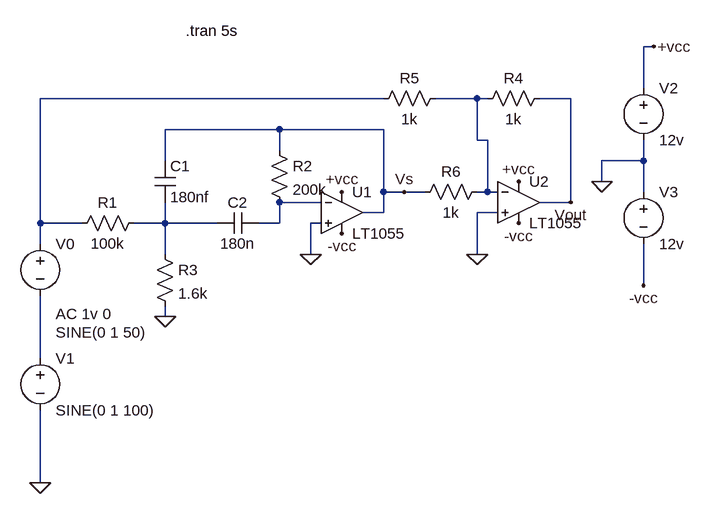
[diagram p0: schematic filtre-exo5.asc]
filtre-exo5.asc, the LTspice schematic file:
Version 4
SHEET 1 952 720
WIRE 880 -96 864 -96
WIRE 864 -32 864 -96
WIRE 464 -16 -64 -16
WIRE 608 -16 544 -16
WIRE 624 -16 608 -16
WIRE 752 -16 704 -16
WIRE 304 32 128 32
WIRE 464 32 304 32
WIRE 608 48 608 -16
WIRE 624 48 608 48
WIRE 304 64 304 32
WIRE 128 80 128 32
WIRE 864 80 864 48
WIRE 864 80 800 80
WIRE 800 112 800 80
WIRE 464 128 464 32
WIRE 496 128 464 128
WIRE 528 128 496 128
WIRE 624 128 624 48
WIRE 624 128 608 128
WIRE 640 128 624 128
WIRE 864 128 864 80
WIRE 368 144 304 144
WIRE 752 144 752 -16
WIRE 752 144 704 144
WIRE 464 160 464 128
WIRE 464 160 432 160
WIRE 640 160 608 160
WIRE -64 176 -64 -16
WIRE 0 176 -64 176
WIRE 128 176 128 144
WIRE 128 176 80 176
WIRE 208 176 128 176
WIRE 304 176 304 144
WIRE 304 176 272 176
WIRE 368 176 352 176
WIRE -64 208 -64 176
WIRE 128 224 128 176
WIRE 352 224 352 176
WIRE 608 224 608 160
WIRE 864 272 864 208
WIRE 128 320 128 304
WIRE -64 384 -64 288
WIRE -64 576 -64 464
FLAG 352 224 0
FLAG -64 576 0
FLAG 800 112 0
FLAG 880 -96 +vcc
FLAG 864 272 -vcc
FLAG 400 128 +vcc
FLAG 400 192 -vcc
FLAG 128 320 0
FLAG 672 112 +vcc
FLAG 672 176 -vcc
FLAG 608 224 0
FLAG 496 128 Vs
FLAG 752 144 Vout
SYMBOL res 96 160 R90
WINDOW 0 0 56 VBottom 2
WINDOW 3 32 56 VTop 2
SYMATTR InstName R1
SYMATTR Value 100k
SYMBOL cap 112 80 R0
SYMATTR InstName C1
SYMATTR Value 180nf
SYMBOL voltage -64 192 R0
WINDOW 3 24 152 Left 2
WINDOW 123 24 124 Left 2
WINDOW 39 0 0 Left 0
SYMATTR Value SINE(0 1 50)
SYMATTR Value2 AC 1v 0
SYMATTR InstName V0
SYMBOL LT1055 400 96 R0
SYMATTR InstName U1
SYMBOL voltage 864 -48 R0
SYMATTR InstName V2
SYMATTR Value 12v
SYMBOL voltage 864 112 R0
SYMATTR InstName V3
SYMATTR Value 12v
SYMBOL res 112 208 R0
SYMATTR InstName R3
SYMATTR Value 1.6k
SYMBOL cap 272 160 R90
WINDOW 0 0 32 VBottom 2
WINDOW 3 32 32 VTop 2
SYMATTR InstName C2
SYMATTR Value 180n
SYMBOL res 288 48 R0
SYMATTR InstName R2
SYMATTR Value 200k
SYMBOL LT1055 672 80 R0
SYMATTR InstName U2
SYMBOL res 720 -32 R90
WINDOW 0 0 56 VBottom 2
WINDOW 3 32 56 VTop 2
SYMATTR InstName R4
SYMATTR Value 1k
SYMBOL res 560 -32 R90
WINDOW 0 0 56 VBottom 2
WINDOW 3 32 56 VTop 2
SYMATTR InstName R5
SYMATTR Value 1k
SYMBOL res 624 112 R90
WINDOW 0 0 56 VBottom 2
WINDOW 3 32 56 VTop 2
SYMATTR InstName R6
SYMATTR Value 1k
SYMBOL Voltage -64 368 R0
SYMATTR InstName V1
SYMATTR Value SINE(0 1 100)
TEXT 160 -120 Left 2 !.tran 5s

The netlist it stands for:
* filtre-exo5.asc
R1 N004 N001 100k
C1 Vs N004 180nf
V0 N001 N005 SINE(0 1 50) AC 1v 0
* U1: LT1055 (symbol LT1055 not available, pins judged from their places): In+=0 In-=N003 V+=+vcc V-=-vcc OUT=Vs
V2 +vcc 0 12v
V3 0 -vcc 12v
R3 N004 0 1.6k
C2 N003 N004 180n
R2 Vs N003 200k
* U2: LT1055 (symbol LT1055 not available, pins judged from their places): In+=0 In-=N002 V+=+vcc V-=-vcc OUT=Vout
R4 Vout N002 1k
R5 N002 N001 1k
R6 N002 Vs 1k
V1 N005 0 SINE(0 1 100)
.tran 5s
.backanno
.end